# EAGLE design 2l-impedance-coupon (EAGLE 9.4.1)
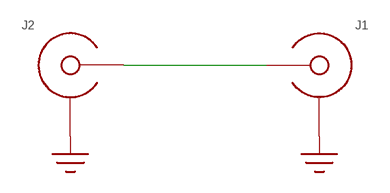
[diagram p0: schematic, sheet 1]

## Parts
J1  SMA-EDGE-LAUNCH4020_TAPER  [SMA_EDGE_LAUNCH_2L_4020_TAPER]
J2  SMA-EDGE-LAUNCH4020_TAPER  [SMA_EDGE_LAUNCH_2L_4020_TAPER]

## Nets
GND: J1.BOTTOM_GND(SHIELD) J1.GND@1(SHIELD) J1.GND@2(SHIELD) J1.GND@3(SHIELD) J1.GND@4(SHIELD) J1.GND@5(SHIELD) J1.GND@6(SHIELD) J1.GND@7(SHIELD) J1.GND@8(SHIELD) J1.GND@14(SHIELD) J1.GND@15(SHIELD) J1.GND@16(SHIELD) J1.GND@17(SHIELD) J1.GND_PAD1(SHIELD) J1.GND_PAD2(SHIELD) J1.P$1(SHIELD) J1.P$2(SHIELD) J2.BOTTOM_GND(SHIELD) J2.GND@1(SHIELD) J2.GND@2(SHIELD) J2.GND@3(SHIELD) J2.GND@4(SHIELD) J2.GND@5(SHIELD) J2.GND@6(SHIELD) J2.GND@7(SHIELD) J2.GND@8(SHIELD) J2.GND@14(SHIELD) J2.GND@15(SHIELD) J2.GND@16(SHIELD) J2.GND@17(SHIELD) J2.GND_PAD1(SHIELD) J2.GND_PAD2(SHIELD) J2.P$1(SHIELD) J2.P$2(SHIELD)
N$1 [29-6]: J1.CENTER@1(CENTER) J2.CENTER@1(CENTER)

## Library data of the parts
J1 J2 = yapo:SMA-EDGE-LAUNCH

## Net classes
1 29-6: width 0.737 mm, clearance 0.152 mm

## Board
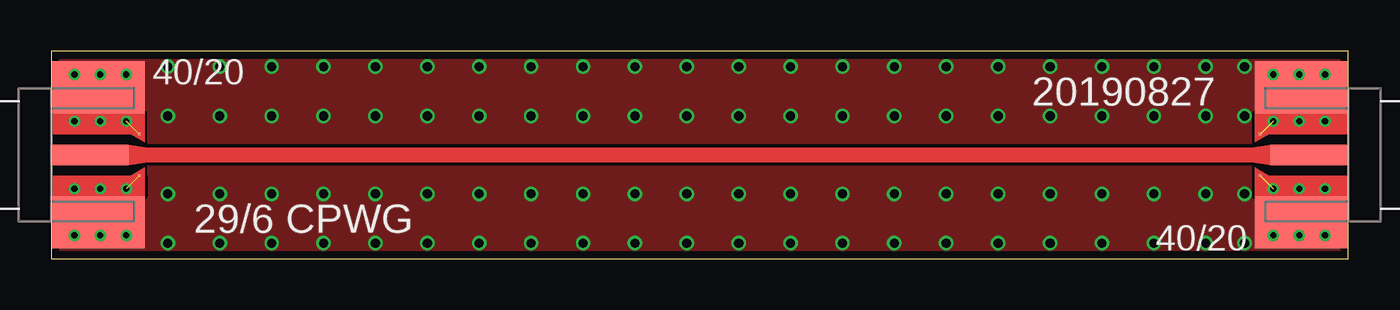
[diagram p1: board, top side]
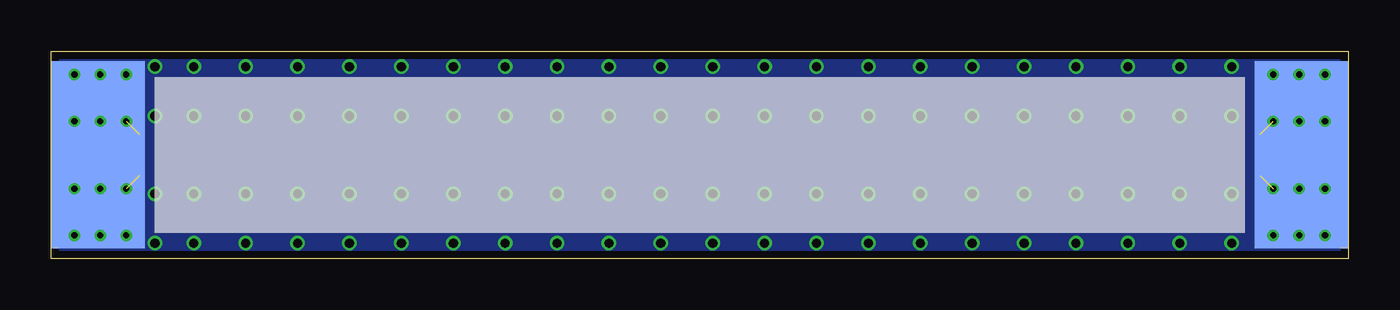
[diagram p2: board, bottom side, seen from below]

Size 63.5 x 10.16 mm. Coordinates in mm from the lower left corner, seen from the top.
Outline: 0,0 63.5,0 63.5,10.16 0,10.16 0,0
Copper layers (1*16): Top 0.035559375mm / dielectric 1.6mm / Bottom 0.035559375mm
Design rules "oshpark-2layer *": minimum track width 6mil, minimum drill 10mil, track to track 6mil, track to pad 6mil, pad to pad 6mil, via to via 6mil, smd to smd 6mil, copper to edge 15mil, drill to drill 6mil, minimum pad ring 5mil, minimum via ring 5mil, stop-mask expansion 2.5mil, vias tented up to drill 20mil, thermal gap 10mil

### Footprints (pad centres in the part's own frame; a part is rotated, then mirrored left to right if it is on the bottom)
SMA_EDGE_LAUNCH_2L_4020_TAPER = smd 4.572 x 9.144 bottom: BOTTOM_GND 2.286,0 | smd 3.81 x 1.016: CENTER@1 1.905,0 | drill 0.3: GND@1 1.143,3.937; GND@2 3.683,3.937; GND@3 1.143,1.651; GND@4 3.683,1.651; GND@5 1.143,-1.651; GND@6 3.683,-1.651; GND@7 1.143,-3.937; GND@8 3.683,-3.937; GND@14 2.413,3.937; GND@15 2.413,-3.937; GND@16 2.413,-1.651; GND@17 2.413,1.651 | smd 4.572 x 2.54: GND_PAD1 2.286,3.302; GND_PAD2 2.286,-3.302 | smd 0.127 x 0.127: P$1 4.318,1.016; P$2 4.318,-1.016

### Placement (x,y rotation side)
J1  63.5,5.08 180 top
J2  0,5.08 0 top

### Tracks (layer width: path | path; a pad name or v marks a point on that pad's centre or on a via)
GND  (via drill 0.45)  (4 unrouted)
  other vias: 5.71,9.4 8.26,9.4 10.79,9.4 13.34,9.4 15.88,9.4 18.41,9.4 20.95,9.4 23.5,9.4 26.04,9.4 28.57,9.4 31.11,9.4 33.66,9.4 36.2,9.4 38.73,9.4 41.27,9.4 43.81,9.4 46.35,9.4 48.9,9.4 51.44,9.4 53.98,9.4 56.52,9.4 58.42,9.4 5.71,6.99 8.26,6.99 10.79,6.99 13.34,6.99 15.88,6.99 18.41,6.99 20.95,6.99 23.5,6.99 26.04,6.99 28.57,6.99 31.11,6.99 33.66,6.99 36.2,6.99 38.73,6.99 41.27,6.99 43.81,6.99 46.35,6.99 48.9,6.99 51.44,6.99 53.98,6.99 56.52,6.99 5.71,3.17 8.26,3.17 10.79,3.17 13.34,3.17 15.88,3.17 18.41,3.17 20.95,3.17 23.5,3.17 26.04,3.17 28.57,3.17 31.11,3.17 33.66,3.17 36.2,3.17 38.73,3.17 41.27,3.17 43.81,3.17 46.35,3.17 48.9,3.17 51.44,3.17 53.98,3.17 56.52,3.17 58.42,6.99 58.42,3.17 5.71,0.76 8.26,0.76 10.79,0.76 13.34,0.76 15.88,0.76 18.41,0.76 20.95,0.76 23.5,0.76 26.04,0.76 28.57,0.76 31.11,0.76 33.66,0.76 36.2,0.76 38.73,0.76 41.27,0.76 43.81,0.76 46.35,0.76 48.9,0.76 51.44,0.76 53.98,0.76 56.52,0.76 58.42,0.76
  pour Top (no thermals): 0,0 63.5,0 63.5,10.16 0,10.16
  pour Bottom (no thermals): 0,0 63.5,0 63.5,10.16 0,10.16
N$1
  Top 0.737: J2.CENTER@1 44.45,5.08 J1.CENTER@1

### Text on the board
tPlace: 20190827 | 29/6 CPWG